# Altium schematic sheet DDR-Memory.SchDoc: FPGA Motherboard for Digital Multiplexed Readout, McGill U.
size B; DocumentNumber: DfMUX12; Revision: Rev0, Prototype; SheetNumber: 12; SheetTotal: 27; PageSetup: Record=PageOptions|CenterHorizontal=True|CenterVertical=True|PrintScale=1.08|XCorrection=1.00|YCorrection=1.00|PrintKind=0|BorderSize=5000000|LeftOffset=0|BottomOffset=0|Orientation=2|PaperLength=1000|PaperWidth=1000|Scale=100|PaperSource=7|PrintQuality=-4|MediaType=1|DitherType=10|PaperKind=Tabloid|PrintScaleMode=1
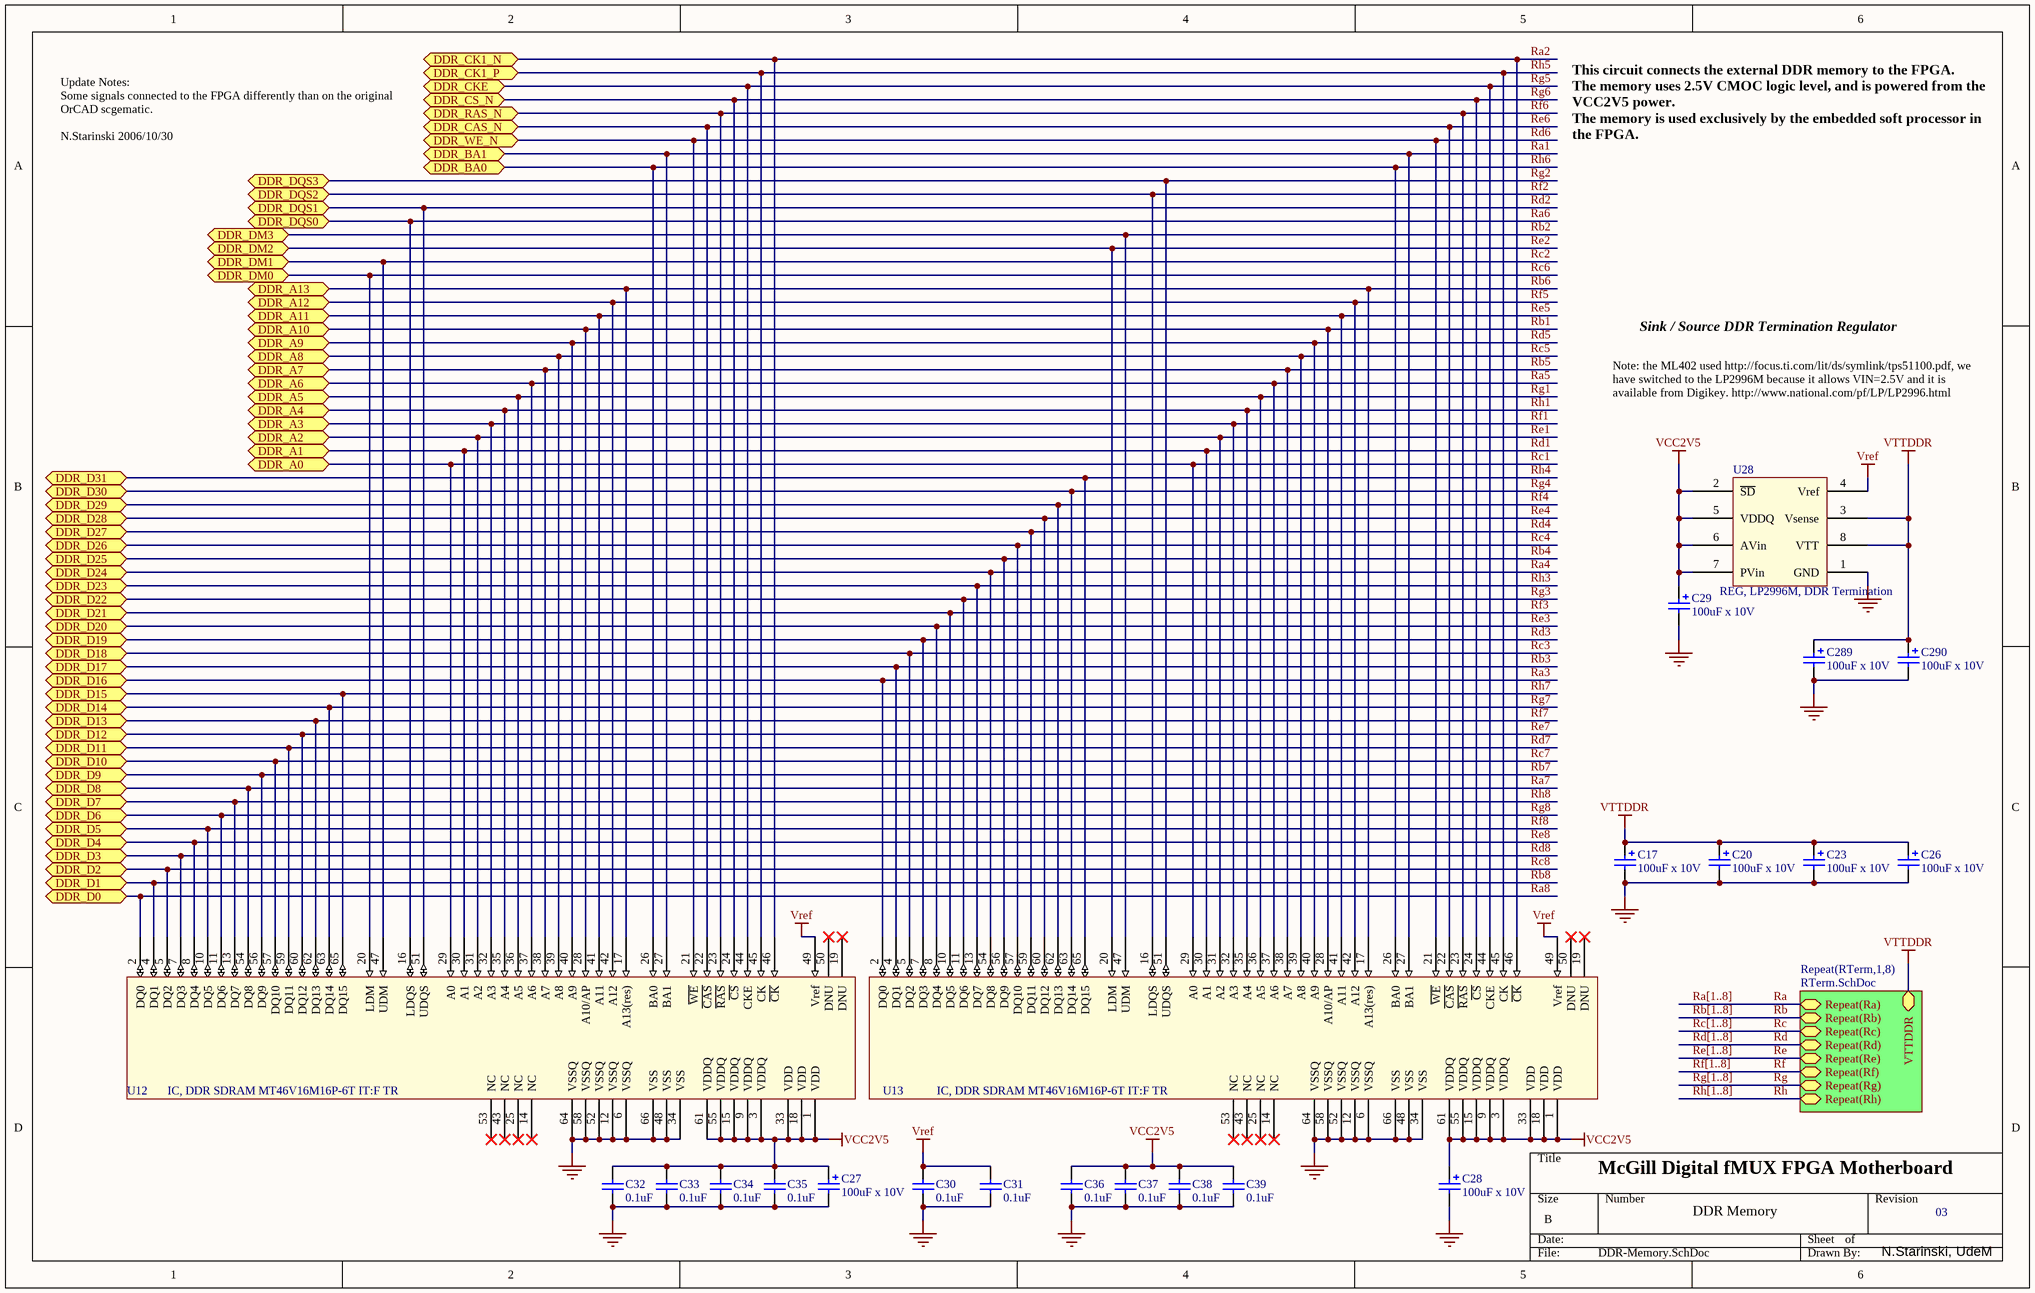
[diagram p0: DDR-Memory.SchDoc]

## Parts
C17  100uF x 10V  [TC6032-2412]
C20  100uF x 10V  [TC6032-2412]
C23  100uF x 10V  [TC6032-2412]
C26  100uF x 10V  [TC6032-2412]
C27  100uF x 10V  [TC6032-2412]
C28  100uF x 10V  [TC6032-2412]
C29  100uF x 10V  [TC6032-2412]
C30  0.1uF  [CC1608-0603]
C31  0.1uF  [CC1608-0603]
C32  0.1uF  [CC1608-0603]
C33  0.1uF  [CC1608-0603]
C34  0.1uF  [CC1608-0603]
C35  0.1uF  [CC1608-0603]
C36  0.1uF  [CC1608-0603]
C37  0.1uF  [CC1608-0603]
C38  0.1uF  [CC1608-0603]
C39  0.1uF  [CC1608-0603]
C289  100uF x 10V  [TC6032-2412]
C290  100uF x 10V  [TC6032-2412]
U12  IC, DDR SDRAM MT46V16M16P-6T IT:F TR  [TSOP-66]
U13  IC, DDR SDRAM MT46V16M16P-6T IT:F TR  [TSOP-66]
U28  REG, LP2996M, DDR Termination  [M08A]

## Sub-sheets
Repeat(RTerm,1,8) = RTerm.SchDoc: Repeat(Ra) (bidir), Repeat(Rb) (bidir), Repeat(Rc) (bidir), Repeat(Rd) (bidir), Repeat(Re) (bidir), Repeat(Rf) (bidir), Repeat(Rg) (bidir), Repeat(Rh) (bidir), VTTDDR (bidir)

## Ports
DDR_A0 (bidir), DDR_A1 (bidir), DDR_A2 (bidir), DDR_A3 (bidir), DDR_A4 (bidir), DDR_A5 (bidir), DDR_A6 (bidir), DDR_A7 (bidir), DDR_A8 (bidir), DDR_A9 (bidir), DDR_A10 (bidir), DDR_A11 (bidir), DDR_A12 (bidir), DDR_A13 (bidir), DDR_BA0 (bidir), DDR_BA1 (bidir), DDR_CAS_N (bidir), DDR_CK1_N (bidir), DDR_CK1_P (bidir), DDR_CKE (bidir), DDR_CS_N (bidir), DDR_D0 (bidir), DDR_D1 (bidir), DDR_D2 (bidir), DDR_D3 (bidir), DDR_D4 (bidir), DDR_D5 (bidir), DDR_D6 (bidir), DDR_D7 (bidir), DDR_D8 (bidir), DDR_D9 (bidir), DDR_D10 (bidir), DDR_D11 (bidir), DDR_D12 (bidir), DDR_D13 (bidir), DDR_D14 (bidir), DDR_D15 (bidir), DDR_D16 (bidir), DDR_D17 (bidir), DDR_D18 (bidir), DDR_D19 (bidir), DDR_D20 (bidir), DDR_D21 (bidir), DDR_D22 (bidir), DDR_D23 (bidir), DDR_D24 (bidir), DDR_D25 (bidir), DDR_D26 (bidir), DDR_D27 (bidir), DDR_D28 (bidir), DDR_D29 (bidir), DDR_D30 (bidir), DDR_D31 (bidir), DDR_DM0 (bidir), DDR_DM1 (bidir), DDR_DM2 (bidir), DDR_DM3 (bidir), DDR_DQS0 (bidir), DDR_DQS1 (bidir), DDR_DQS2 (bidir), DDR_DQS3 (bidir), DDR_RAS_N (bidir), DDR_WE_N (bidir)

## Nets
GND: C17.2 C20.2 C23.2 C26.2 C27.2 C28.2 C29.2 C30.1 C31.1 C32.1 C33.1 C34.1 C35.1 C36.1 C37.1 C38.1 C39.1 C289.2 C290.2 U12.6(VSSQ) U12.12(VSSQ) U12.34(VSS) U12.48(VSS) U12.52(VSSQ) U12.58(VSSQ) U12.64(VSSQ) U12.66(VSS) U13.6(VSSQ) U13.12(VSSQ) U13.34(VSS) U13.48(VSS) U13.52(VSSQ) U13.58(VSSQ) U13.64(VSSQ) U13.66(VSS) U28.1(GND)
VCC2V5: C27.1 C28.1 C29.1 C32.2 C33.2 C34.2 C35.2 C36.2 C37.2 C38.2 C39.2 U12.1(VDD) U12.3(VDDQ) U12.9(VDDQ) U12.15(VDDQ) U12.18(VDD) U12.33(VDD) U12.55(VDDQ) U12.61(VDDQ) U13.1(VDD) U13.3(VDDQ) U13.9(VDDQ) U13.15(VDDQ) U13.18(VDD) U13.33(VDD) U13.55(VDDQ) U13.61(VDDQ) U28.2(~{SD}) U28.5(VDDQ) U28.6(AVin) U28.7(PVin)
Vref: C30.2 C31.2 U12.49(Vref) U13.49(Vref) U28.4(Vref)
VTTDDR: C17.1 C20.1 C23.1 C26.1 C289.1 C290.1 U28.3(Vsense) U28.8(VTT) ; sheet Repeat(RTerm,1,8)/VTTDDR
Ra: sheet Repeat(RTerm,1,8)/Repeat(Ra)
Ra1: U12.27(BA1) U13.27(BA1) ; port DDR_BA1
Ra2: U12.46(~{CK}) U13.46(~{CK}) ; port DDR_CK1_N
Ra3: U13.2(DQ0) ; port DDR_D16
Ra4: U13.54(DQ8) ; port DDR_D24
Ra5: U12.37(A6) U13.37(A6) ; port DDR_A6
Ra6: U12.16(LDQS) ; port DDR_DQS0
Ra7: U12.54(DQ8) ; port DDR_D8
Ra8: U12.2(DQ0) ; port DDR_D0
Rb: sheet Repeat(RTerm,1,8)/Repeat(Rb)
Rb1: U12.28(A10/AP) U13.28(A10/AP) ; port DDR_A10
Rb2: U13.47(UDM) ; port DDR_DM3
Rb3: U13.4(DQ1) ; port DDR_D17
Rb4: U13.56(DQ9) ; port DDR_D25
Rb5: U12.38(A7) U13.38(A7) ; port DDR_A7
Rb6: U12.17(A13(res)) U13.17(A13(res)) ; port DDR_A13
Rb7: U12.56(DQ9) ; port DDR_D9
Rb8: U12.4(DQ1) ; port DDR_D1
Rc: sheet Repeat(RTerm,1,8)/Repeat(Rc)
Rc1: U12.29(A0) U13.29(A0) ; port DDR_A0
Rc2: U12.47(UDM) ; port DDR_DM1
Rc3: U13.5(DQ2) ; port DDR_D18
Rc4: U13.57(DQ10) ; port DDR_D26
Rc5: U12.39(A8) U13.39(A8) ; port DDR_A8
Rc6: U12.20(LDM) ; port DDR_DM0
Rc7: U12.57(DQ10) ; port DDR_D10
Rc8: U12.5(DQ2) ; port DDR_D2
Rd: sheet Repeat(RTerm,1,8)/Repeat(Rd)
Rd1: U12.30(A1) U13.30(A1) ; port DDR_A1
Rd2: U12.51(UDQS) ; port DDR_DQS1
Rd3: U13.7(DQ3) ; port DDR_D19
Rd4: U13.59(DQ11) ; port DDR_D27
Rd5: U12.40(A9) U13.40(A9) ; port DDR_A9
Rd6: U12.21(~{WE}) U13.21(~{WE}) ; port DDR_WE_N
Rd7: U12.59(DQ11) ; port DDR_D11
Rd8: U12.7(DQ3) ; port DDR_D3
Re: sheet Repeat(RTerm,1,8)/Repeat(Re)
Re1: U12.31(A2) U13.31(A2) ; port DDR_A2
Re2: U13.20(LDM) ; port DDR_DM2
Re3: U13.8(DQ4) ; port DDR_D20
Re4: U13.60(DQ12) ; port DDR_D28
Re5: U12.41(A11) U13.41(A11) ; port DDR_A11
Re6: U12.22(~{CAS}) U13.22(~{CAS}) ; port DDR_CAS_N
Re7: U12.60(DQ12) ; port DDR_D12
Re8: U12.8(DQ4) ; port DDR_D4
Rf: sheet Repeat(RTerm,1,8)/Repeat(Rf)
Rf1: U12.32(A3) U13.32(A3) ; port DDR_A3
Rf2: U13.16(LDQS) ; port DDR_DQS2
Rf3: U13.10(DQ5) ; port DDR_D21
Rf4: U13.62(DQ13) ; port DDR_D29
Rf5: U12.42(A12) U13.42(A12) ; port DDR_A12
Rf6: U12.23(~{RAS}) U13.23(~{RAS}) ; port DDR_RAS_N
Rf7: U12.62(DQ13) ; port DDR_D13
Rf8: U12.10(DQ5) ; port DDR_D5
Rg: sheet Repeat(RTerm,1,8)/Repeat(Rg)
Rg1: U12.36(A5) U13.36(A5) ; port DDR_A5
Rg2: U13.51(UDQS) ; port DDR_DQS3
Rg3: U13.11(DQ6) ; port DDR_D22
Rg4: U13.63(DQ14) ; port DDR_D30
Rg5: U12.44(CKE) U13.44(CKE) ; port DDR_CKE
Rg6: U12.24(~{CS}) U13.24(~{CS}) ; port DDR_CS_N
Rg7: U12.63(DQ14) ; port DDR_D14
Rg8: U12.11(DQ6) ; port DDR_D6
Rh: sheet Repeat(RTerm,1,8)/Repeat(Rh)
Rh1: U12.35(A4) U13.35(A4) ; port DDR_A4
Rh3: U13.13(DQ7) ; port DDR_D23
Rh4: U13.65(DQ15) ; port DDR_D31
Rh5: U12.45(CK) U13.45(CK) ; port DDR_CK1_P
Rh6: U12.26(BA0) U13.26(BA0) ; port DDR_BA0
Rh7: U12.65(DQ15) ; port DDR_D15
Rh8: U12.13(DQ7) ; port DDR_D7

Not connected (* = marked no-connect by the designer): U12 14(NC)* 19(DNU)* 25(NC)* 43(NC)* 50(DNU)* 53(NC)*; U13 14(NC)* 19(DNU)* 25(NC)* 43(NC)* 50(DNU)* 53(NC)*

## Buses and harness runs
bus Ra[1..8]
bus Rb[1..8]
bus Rc[1..8]
bus Rd[1..8]
bus Re[1..8]
bus Rf[1..8]
bus Rg[1..8]
bus Rh[1..8]

## Notes on the sheet
- Update Notes:
  Some signals connected to the FPGA differently than on the original OrCAD scgematic.
  N.Starinski 2006/10/30
- This circuit connects the external DDR memory to the FPGA.
  The memory uses 2.5V CMOC logic level, and is powered from the VCC2V5 power.
  The memory is used exclusively by the embedded soft processor in the FPGA.
- Sink / Source DDR Termination Regulator
- Note: the ML402 used http://focus.ti.com/lit/ds/symlink/tps51100.pdf, we have switched to the LP2996M because it allows VIN=2.5V and it is available from Digikey. http://www.national.com/pf/LP/LP2996.html
- McGill Digital fMUX FPGA Motherboard
- DDR Memory
- 03
- N.Starinski, UdeM

## Library data of the parts
C17 C20 C23 C26-C29 C289 C290 = Cap Pol3: CAP TANTC TPSC107K010R0075; Published: 8-Jun-2000; LatestRevisionDate: 17-Jul-2002; LatestRevisionNote: Re-released for DXP Platform.; PackageReference: C0805; Publisher: Altium Limited
C30-C39 = Cap Semi: Capacitor (Semiconductor SIM Model); Published: 8-Jun-2000; LatestRevisionDate: 17-Jul-2002; LatestRevisionNote: Re-released for DXP Platform.; PackageReference: C1206; Publisher: Altium Limited
U12 U13 = MT46V16M16: 256Mb, 4Meg X 16 X 4 banks DDR SDRAM
U28 = LP2996: DDR Termination Regulator